# Altium schematic sheet SerialCommunication1.SchDoc
size A3; SheetNumber: 9; SheetTotal: 11
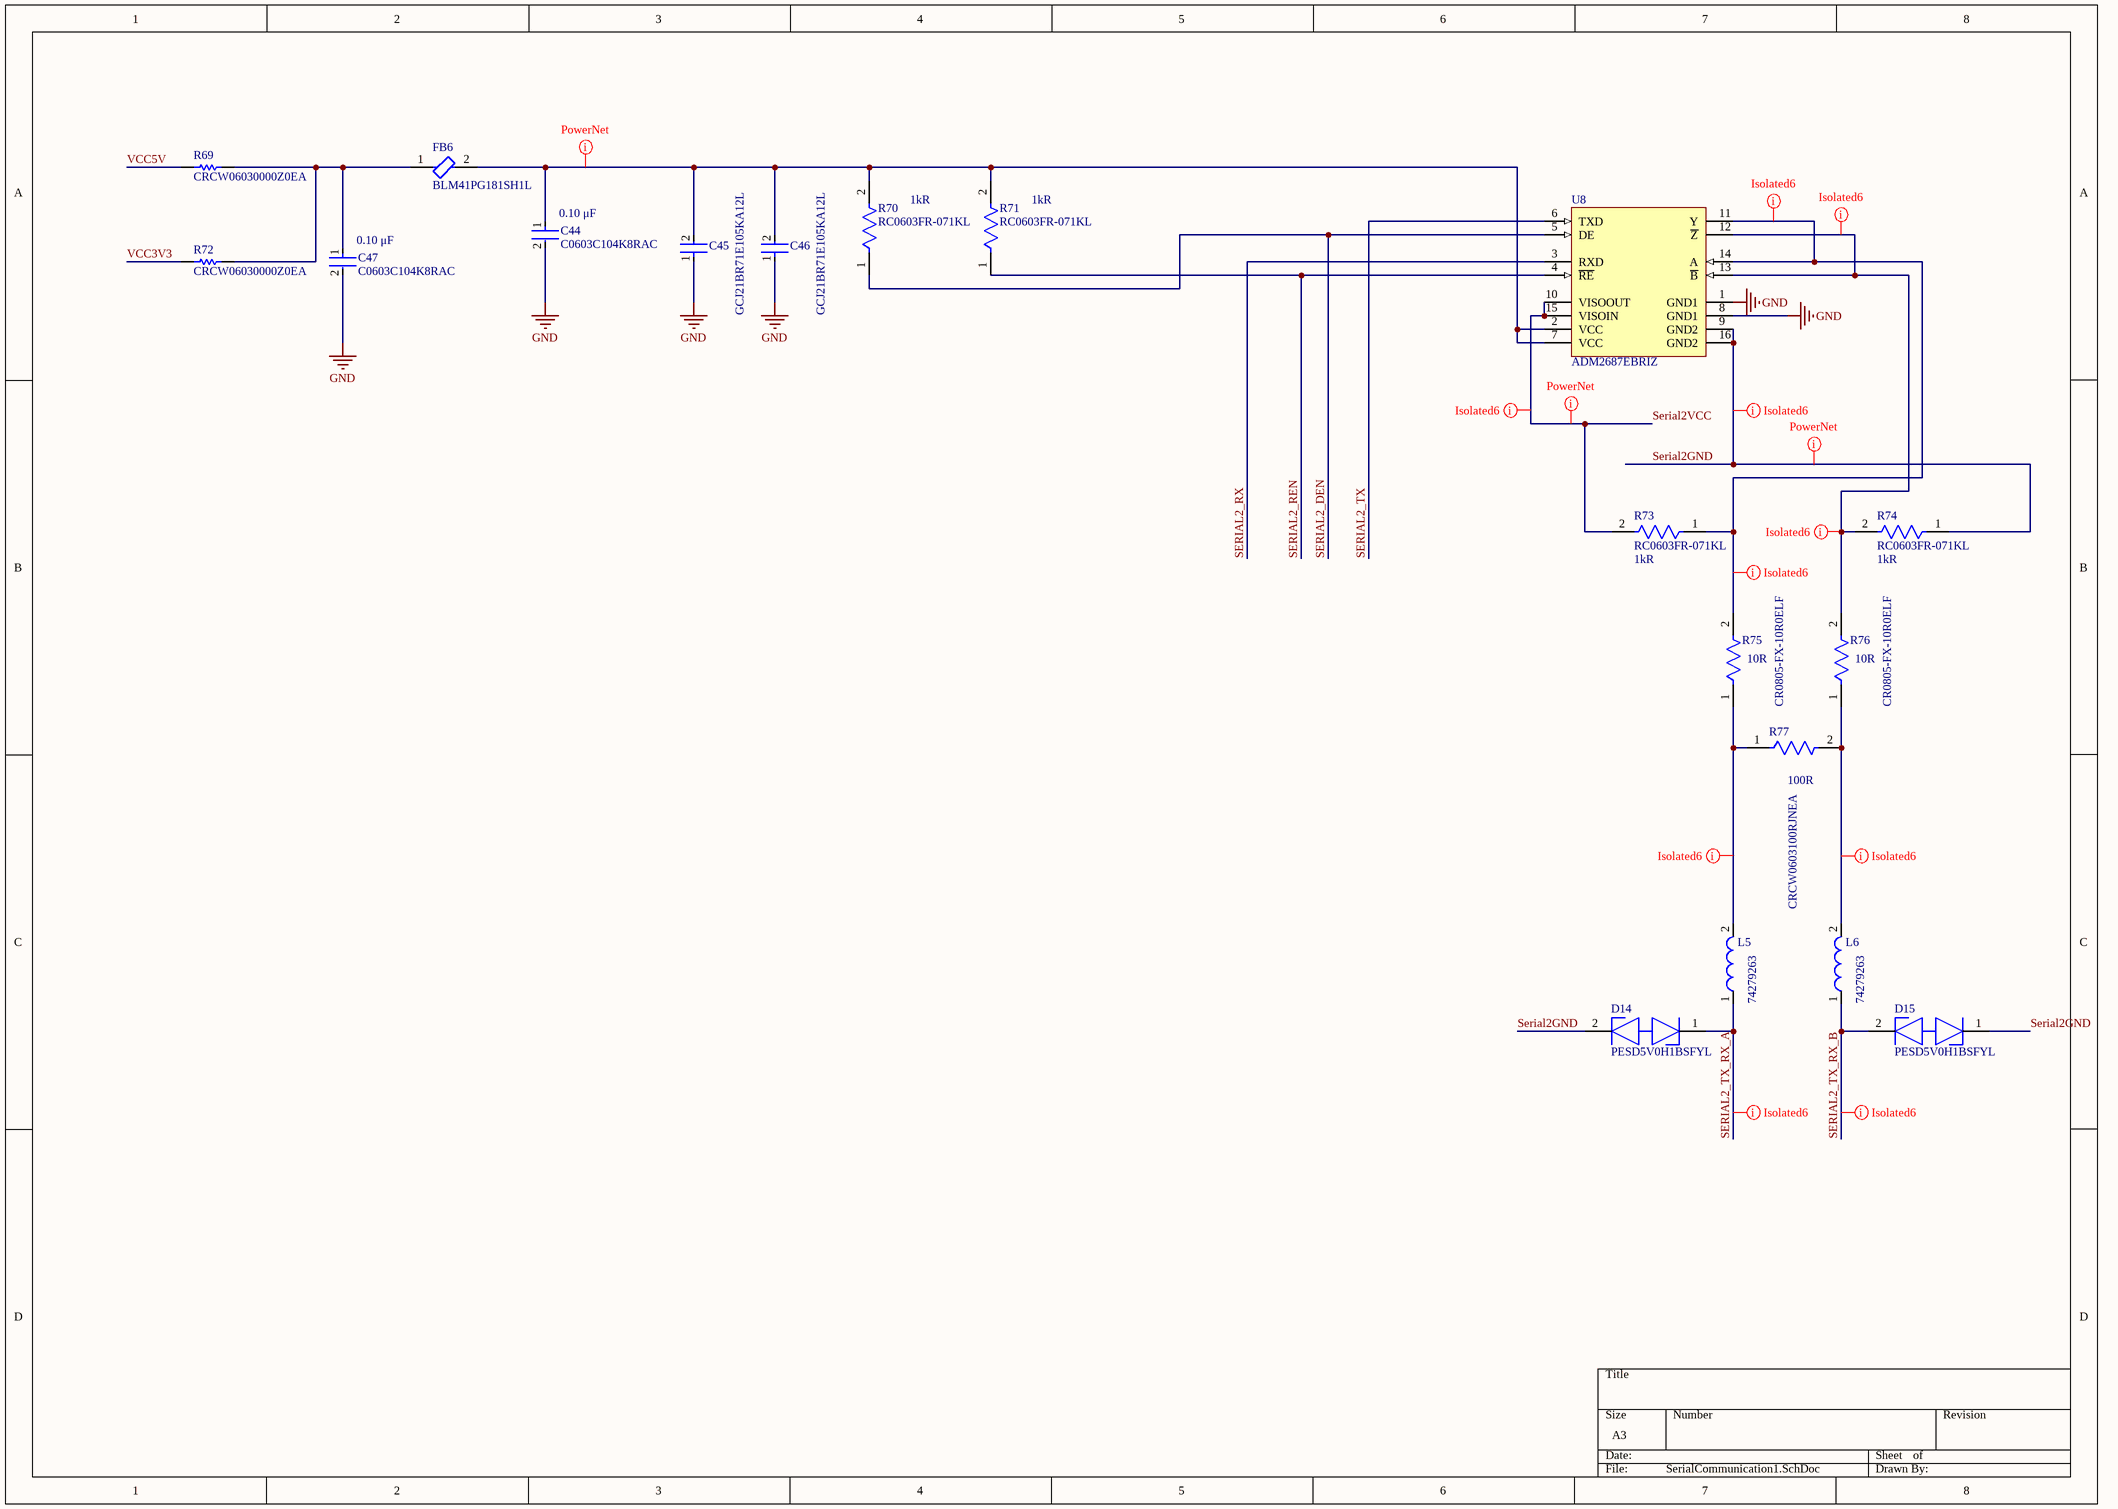
[diagram p0: SerialCommunication1.SchDoc]

## Parts
C44  C0603C104K8RAC  Capacitance: 0.10 μF  [FP-C0603C-CF-MFG]
C45  GCJ21BR71E105KA12L  [FP-GCJ21B-0_3-MFG]
C46  GCJ21BR71E105KA12L  [FP-GCJ21B-0_3-MFG]
C47  C0603C104K8RAC  Capacitance: 0.10 μF  [FP-C0603C-CF-MFG]
D14  PESD5V0H1BSFYL  [FP-SOD962-2-MFG]
D15  PESD5V0H1BSFYL  [FP-SOD962-2-MFG]
FB6  BLM41PG181SH1L  [FP-BLM41-0_2-a1_2-MFG]
L5  74279263  [SMD-0603]
L6  74279263  [SMD-0603]
R69  CRCW06030000Z0EA  [RESC1609X50X30NL8T20]
R70  RC0603FR-071KL  Resistance: 1kR  [FP-RC0603-0_55-IPC_C]
R71  RC0603FR-071KL  Resistance: 1kR  [FP-RC0603-0_55-IPC_C]
R72  CRCW06030000Z0EA  [RESC1609X50X30NL8T20]
R73  RC0603FR-071KL  Resistance: 1kR  [FP-RC0603-0_55-IPC_C]
R74  RC0603FR-071KL  Resistance: 1kR  [FP-RC0603-0_55-IPC_C]
R75  CR0805-FX-10R0ELF  Resistance: 10R  [FP-CR0805-IPC_B]
R76  CR0805-FX-10R0ELF  Resistance: 10R  [FP-CR0805-IPC_B]
R77  CRCW0603100RJNEA  Resistance: 100R  [FP-CRCW0603-e3-IPC_B]
U8  ADM2687EBRIZ  [ADI-RI-16-2_L]

## Nets
GND: C44.2 C45.1 C46.1 C47.2 U8.1(GND1) U8.8(GND1)
SERIAL2_DEN: R70.1 U8.5(DE)
SERIAL2_REN: R71.1 U8.4(~{RE})
SERIAL2_RX: U8.3(RXD)
SERIAL2_TX: U8.6(TXD)
SERIAL2_TX_RX_A: D14.1(K1) L5.1
SERIAL2_TX_RX_B: D15.2(K2) L6.1
Serial2GND: D14.2(K2) D15.1(K1) R74.1 U8.9(GND2) U8.16(GND2)
Serial2VCC: R73.2 U8.10(VISOOUT) U8.15(VISOIN)
VCC3V3: R72.1
VCC5V: R69.1
NetC44_1: C44.1 C45.2 C46.2 FB6.2 R70.2 R71.2 U8.2(VCC) U8.7(VCC)
NetC47_1: C47.1 FB6.1 R69.2 R72.2
NetL5_2: L5.2 R75.1 R77.1
NetL6_2: L6.2 R76.1 R77.2
NetR73_1: R73.1 R75.2 U8.11(Y) U8.14(A)
NetR74_2: R74.2 R76.2 U8.12(~{Z}) U8.13(~{B})

## Layout directives
net class Isolated6: NetL5_2, NetL6_2, NetR73_1, NetR74_2, SERIAL2_TX_RX_A, SERIAL2_TX_RX_B, Serial2GND, Serial2VCC
net class Power: NetC44_1, Serial2GND, Serial2VCC

## Library data of the parts
C44 C47 = CMP-03020-006081-2: C0603 0.10 μF X7R 30ppm/°C 10.00% 10 V; Manufacturer: KEMET; Value: 0.10 μF; Material: Ceramic; Automotive Grade: Grade 1; Voltage Rating: 10 V; Tolerance: 0.1; Automotive: Yes; Device Class L2: Capacitors; Height: 0.87mm; Temperature Range High: +125°C; Temperature Coefficient: 30ppm/°C; Temperature Range Low: -55°C; Package: C0603C-CF; Lead Free: Yes; Octopart: https://octopart.com/c0603c104k8rac-kemet-1325403; Manufacturer Part Number: C0603C104K8RAC; Temperature: -55°C to +125°C; Mouser Description: .1UF 10V 10% 0603; RoHS: TRUE; ComponentLink2URL: https://api.kemet.com/component-edge/download/datasheet/C0603C100J5GACAUTO.pdf; ComponentLink2Description: Datasheet; Temperature Characteristic: X7R; Device Class L1: Passive Components; Category: Cap; Device Class L3: Ceramic Capacitors
C45 C46 = CMP-2007-03211-2: Multilayer Ceramic Capacitors MLCC - SMD/SMT 0805 1uF 10%, 25VDC,  X7R 15%; Voltage Rating (DC): 25V; Package Quantity: 3000; Depth: 1.25mm; Packaging: Tape and Reel; Voltage Rating: 25V; Max Operating Temperature: 125°C; Ratings: AEC-Q200; Width: 1.25mm; Min Operating Temperature: -55°C; Termination: SMD/SMT; Lead Free: Lead Free; Dielectric: X7R; Length: 2mm; Thickness: 0.057inch; Capacitance: 1uF; Tolerance: 10%; Case Code (Metric): 2012; Case/Package: 0805; Mount: Surface Mount; Features: Soft Termination; Case Code (Imperial): 0805
D14 D15 = CMP-14436-000004-1: TVS DIODE 5V 5V DSN0603-2; Manufacturer: Nexperia; Breakdown Voltage: 6V; Direction: Bidirectional; Value: 0.15pF; Clamping Voltage: 6.3V; Number Of Channels: 1; Peak Pulse Current: 7A; Max Junction Temp: +150°C; Lead Free: Yes; Reverse Standoff Voltage: 5V; Footprint Url: https://assets.nexperia.com/documents/outline-drawing/SOD962-2.pdf; ComponentLink2Description: Datasheet; Height: 0.32mm; Ambient Temperature Range Low: -40°C; Manufacturer Part Number: PESD5V0H1BSFYL; Octopart: https://octopart.com/pesd5v0h1bsfyl-nexperia-78741149; Ambient Temperature Range High: +125°C; RoHS: TRUE; Temperature: to +150°C; Capacitance: 0.15pF; ComponentLink2URL: https://assets.nexperia.com/documents/data-sheet/PESD5V0H1BSF.pdf; Temperature Range High: +150°C; Device Class L2: TVS Diodes; Digikey Description: TVS DIODE 5V 5V DSN0603-2; Category: Diode; Device Class L3: unset; Device Class L1: Circuit Protection; Package: SOD962-2; Automotive: No
FB6 = CMP-06046-002023-1: Ferrite Bead, 1806, 180Ω @ 100MHz, 25%, 0.02Ω, 3.5A; Impedance: 180R; Number of Lines: 1; Max DC Current: 50mA; DC Resistance (DCR): 20mR; Mount: Surface Mount; Length: 4.5mm; Tolerance: 25%; Series: EMIFIL®, BLM41P; Package Quantity: 2500; Min Operating Temperature: -55°C; Max Operating Temperature: 125°C; Height: 0.071inch; Packaging: Tape and Reel; Contact Plating: Tin; Test Frequency: 100MHz; Ratings: AEC-Q200; Case Code (Metric): 4516; Termination: SMD/SMT; Case Code (Imperial): 1806; Width: 0.063inch; Max Current Rating: 3.5A; Case/Package: 1806
L5 L6 = CMP-0220-00148-1: SMD EMI Suppression Ferrite Bead WE-CBF, Z = 220 Ohm; Impedance: 220 Ohm; PackageVersion: 2009; ComponentLink2URL: http://www.we-online.de/katalog/media/pdf/74279263.pdf; PackageDescription: Chip Inductor, 2-Leads, Body 1.6 x 0.8 mm; PackageReference: SMD-0603; ComponentLink1URL: http://www.we-online.com; ComponentLink2Description: Datasheet; ComponentLink1Description: Manufacturer Link; DatasheetVersion: Dec-2005
R69 R72 = CMP-2000-03816-5: Chip Resistor, 0 Ohm, Jumper, 100 mW, -55 to 155 degC, 0603 (1608 Metric), RoHS, Tape and Reel; Manufacturer: Vishay Semiconductor; Voltage Rating: 75 V; Package Quantity: 5000; DatasheetVersion: 06/2012; Min Operating Temperature: -55 degC; ComponentLink1URL: http://www.vishay.com/; Mounting Technology: Surface Mount; Height: 0.45 mm; ComponentLink1Description: Manufacturer URL; REACH SVHC: Unknown; PackageReference: 0603; Packaging: Tape and Reel; Max Operating Temperature: 155 degC; Mount: Surface Mount; ComponentLink2Description: Datasheet; PackageDescription: 2-Pin Surface Mount Device, Body 1.575 x 0.85 mm; Length: 1.55 mm; ComponentLink2URL: http://www.vishay.com/docs/20035/dcrcwe3.pdf; Pins: 2; RoHSCompliant: true
R70 R71 R73 R74 = CMP-1659-00009-5: RES 1K OHM 1% 1/10W 0603; Voltage Rating: 50V; Power Rating: 100mW; Temperature Coefficient: 100ppm/°C; Military Standard: Not; REACH SVHC: No SVHC; Size Code: 0603; Features: Moisture Resistant; Number of Terminations: 2; Technology: THICK FILM; Series: RC; Case Code (Metric): 1608; Resistance Tolerance: 1%; Resistor Type: Thick Film; Termination: SMD/SMT; Contact Plating: Tin; Radiation Hardening: No; Min Operating Temperature: -55°C; Max Operating Temperature: 155°C; Packaging: Tape and Reel; Max Power Dissipation: 100mW; RoHS Compliant: Yes; Height: 0.45mm; Lead Free: Lead Free; Case/Package: 0603; Length: 1.6mm; Tolerance: 1%; Case Code (Imperial): 0603; Construction: Rectangular; Depth: 0.8mm
R75 R76 = CMP-07231-004657-1: Thick Film Chip Resistors 0805 10Ω 0.125W 1% 100ppm/°C; Voltage Rating (DC): 150V; Power Rating: 125mW; Tolerance: 1%; Min Operating Temperature: -55°C; Length: 2mm; Case Code (Metric): 2012; Temperature Coefficient: 100ppm/°C; Height: 0.5mm; Max Operating Temperature: 155°C; Case/Package: 0805; Width: 1.25mm; Composition: Thick Film; Contact Plating: Tin; Termination: SMD/SMT; Packaging: Tape and Reel; REACH SVHC: No SVHC; Number of Pins: 2; Package Quantity: 5000; Mount: Surface Mount; Military Standard: Not; Thickness: 508um; Case Code (Imperial): 0805; Depth: 1.25mm; Radiation Hardening: No; Voltage Rating: 150V
R77 = CMP-2000-03827-2: RES Thick Film, 100Ω, 5%, 0.1W, 200ppm/°C, 0603; Power Rating: 100mW; Voltage Rating: 75V; Weight: 7.1E-05oz; Max Operating Temperature: 155°C; Military Standard: Not; Case Code (Imperial): 0603; Case/Package: 0603; Packaging: Tape and Reel; Number of Terminations: 2; Package Quantity: 1; Radiation Hardening: No; Termination: SMD/SMT; Case Code (Metric): 1608; Min Operating Temperature: -55°C; Height: 0.02inch; Length: 1.55mm; Tolerance: 5%; Width: 0.85mm; Contact Plating: Tin; Max Power Dissipation: 100mW; Features: Automotive AEC-Q200; Composition: Thick Film; Temperature Coefficient: 200ppm/°C; Depth: 0.85mm
U8 = CMP-0528-00004-2: 5 kV rms Signal and Power Isolated, RS-485 I/O pins, 500 kbps, -40 to 85 degC, 16-Pin SOIC (RI-16-2), Pb-Free; Manufacturer: Analog Devices; Pwr Supply (Vnom): +3.3, +5; Insulation Rating (kVrms): 5 KV rms; # of Nodes On Bus: 256; Driver/Receiver Enable: Yes; ESD Protection V: 15 kV; DataRate RS-485: 500 Kbps; RoHS: TRUE; Mounting Technology: Surface Mount; PackageDescription: 16-Pin Standard Small Outline Package, Body 12.75 x 7.5 mm, Pitch 1.27 mm; DatasheetVersion: Rev. A; ComponentLink3URL: http://www.analog.com/static/imported-files/data_sheets/ADM2682E_2687E.pdf; ComponentLink2Description: Datasheet; ComponentLink2URL: http://www.analog.com/static/imported-files/data_sheets/ADM2682E_2687E.pdf; Operating Temperature Range: -40 to 85 degC; PartNumber: ADM2687EBRIZ; Integrated isoPower: Yes; ComponentLink1Description: Manufacturer URL; ComponentLink1URL: http://www.analog.com/; ComponentLink3Description: Package Specification; Package: 16-Lead SOIC; PackageReference: RI-16-2